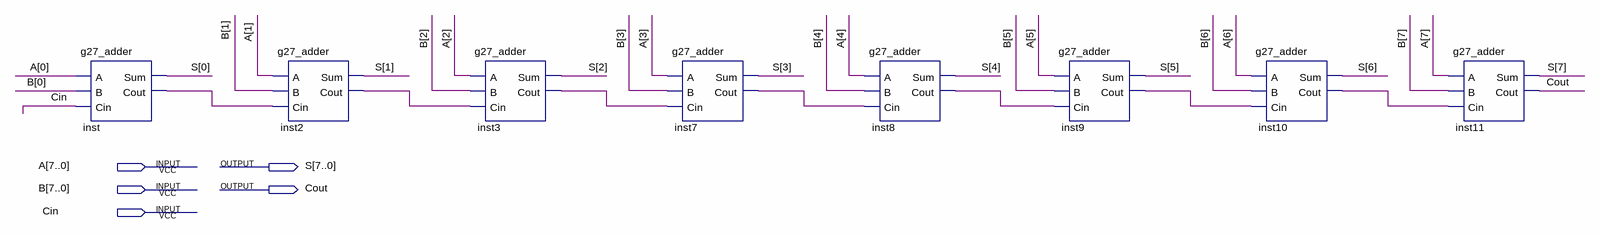
[diagram p0: schematic sheet]
// Quartus schematic g27_8bit_adder.bdf as structural Verilog: 8 symbols, 5 pins
module g27_8bit_adder (
  input  [7:0] A,
  input  [7:0] B,
  input  Cin,
  output [7:0] S,
  output Cout
);

  wire inst2_cout, inst3_cout, inst7_cout, inst8_cout, inst9_cout, inst10_cout, inst_cout;

  g27_adder inst (.A(A[0]), .B(B[0]), .Cin(Cin), .Sum(S[0]), .Cout(inst_cout));
  g27_adder inst2 (.A(A[1]), .B(B[1]), .Cin(inst_cout), .Sum(S[1]), .Cout(inst2_cout));
  g27_adder inst3 (.A(A[2]), .B(B[2]), .Cin(inst2_cout), .Sum(S[2]), .Cout(inst3_cout));
  g27_adder inst7 (.A(A[3]), .B(B[3]), .Cin(inst3_cout), .Sum(S[3]), .Cout(inst7_cout));
  g27_adder inst8 (.A(A[4]), .B(B[4]), .Cin(inst7_cout), .Sum(S[4]), .Cout(inst8_cout));
  g27_adder inst9 (.A(A[5]), .B(B[5]), .Cin(inst8_cout), .Sum(S[5]), .Cout(inst9_cout));
  g27_adder inst10 (.A(A[6]), .B(B[6]), .Cin(inst9_cout), .Sum(S[6]), .Cout(inst10_cout));
  g27_adder inst11 (.A(A[7]), .B(B[7]), .Cin(inst10_cout), .Sum(S[7]), .Cout(Cout));
endmodule
